# Altium schematic sheet KHKT25.SchDoc
size A
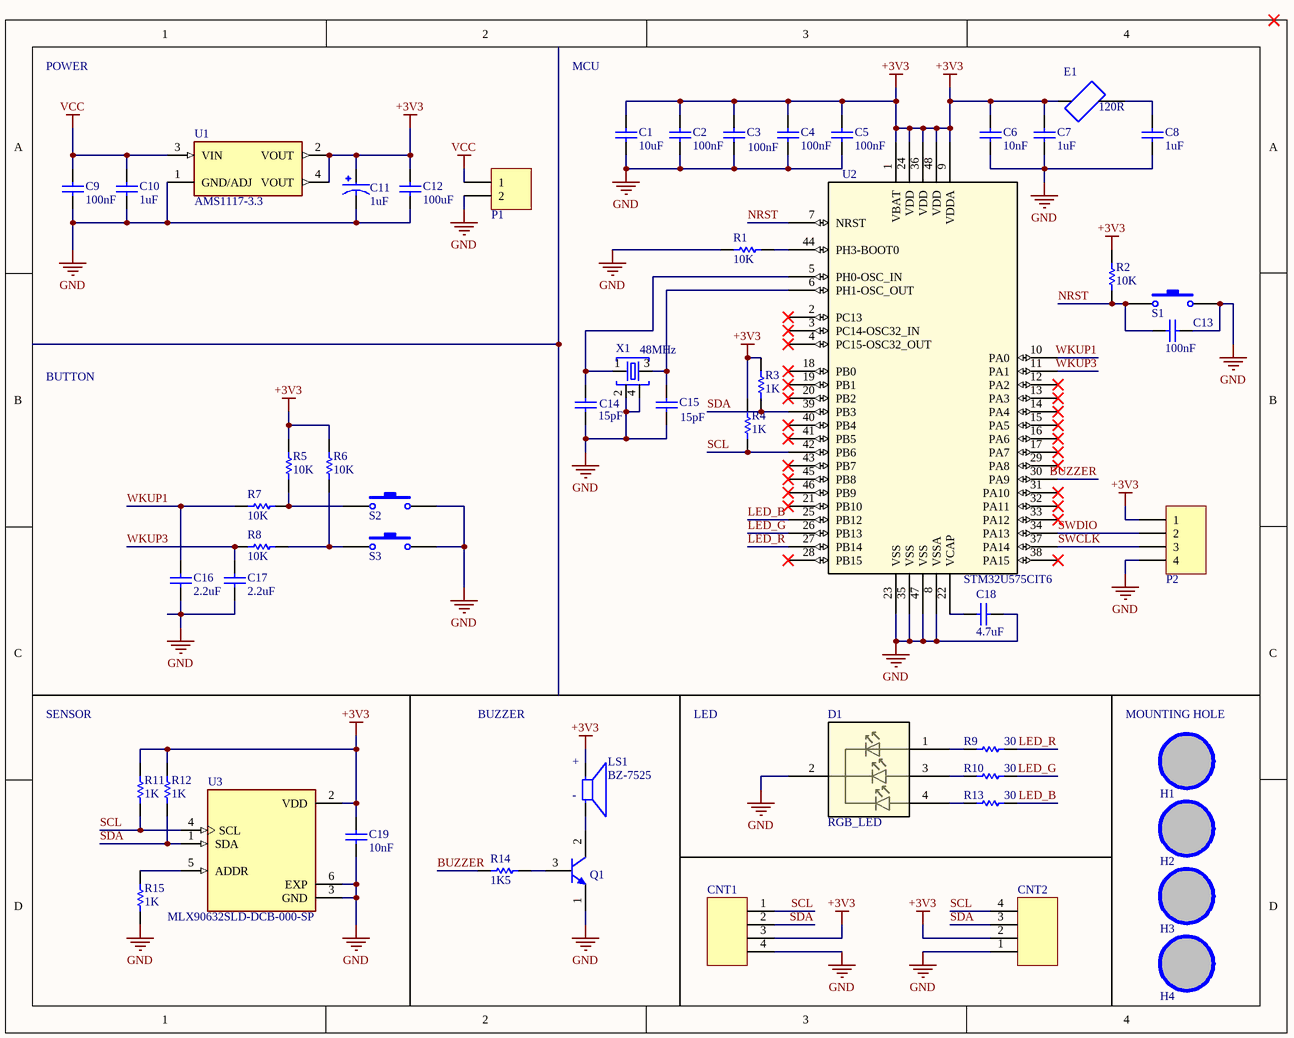
[diagram p0: KHKT25.SchDoc]

## Parts
C1  value 10uF  [CAP-SM-0603]  (hidden comment: Cap Non-Pol SMD)
C2  value 100nF  [CAP-SM-0603]  (hidden comment: Cap Non-Pol SMD)
C3  value 100nF  [CAP-SM-0603]  (hidden comment: Cap Non-Pol SMD)
C4  value 100nF  [CAP-SM-0603]  (hidden comment: Cap Non-Pol SMD)
C5  value 100nF  [CAP-SM-0603]  (hidden comment: Cap Non-Pol SMD)
C6  value 10nF  [CAP-SM-0603]  (hidden comment: Cap Non-Pol SMD)
C7  value 1uF  [CAP-SM-0603]  (hidden comment: Cap Non-Pol SMD)
C8  value 1uF  [CAP-SM-0603]  (hidden comment: Cap Non-Pol SMD)
C9  value 100nF  [CAP-SM-0603]  (hidden comment: Cap Non-Pol SMD)
C10  value 1uF  [CAP-SM-0603]  (hidden comment: Cap Non-Pol SMD)
C11  1uF  [CAP_TAN_3216]
C12  value 100uF  [CAP-SM-0603]  (hidden comment: Cap Non-Pol SMD)
C13  value 100nF  [CAP-SM-0603]  (hidden comment: Cap Non-Pol SMD)
C14  value 15pF  [CAP-SM-0603]  (hidden comment: Cap Non-Pol SMD)
C15  value 15pF  [CAP-SM-0603]  (hidden comment: Cap Non-Pol SMD)
C16  value 2.2uF  [CAP-SM-0603]  (hidden comment: Cap Non-Pol SMD)
C17  value 2.2uF  [CAP-SM-0603]  (hidden comment: Cap Non-Pol SMD)
C18  value 4.7uF  [CAP-SM-0603]  (hidden comment: Cap Non-Pol SMD)
C19  value 10nF  [CAP_0402]  (hidden comment: Cap Non-Pol SMD)
CNT1  HF4X1  [FPC_FFC_4P]  (value not drawn)
CNT2  HF4X1  [FPC_FFC_4P]  (value not drawn)
D1  RGB_LED  [RGB_LED]
E1  120R  [FB_MI0805K400R-10]
H1  Hole  [LO KHOAN 3MM]  (value not drawn)
H2  Hole  [LO KHOAN 3MM]  (value not drawn)
H3  Hole  [LO KHOAN 3MM]  (value not drawn)
H4  Hole  [LO KHOAN 3MM]  (value not drawn)
LS1  BZ-7525  [XDCCMT-7525]
P1  Header 2  [DOMINO_2P]  (value not drawn)
P2  Header 4H  [JP4]  (value not drawn)
Q1  C1815  [SOT23B]  (value not drawn)
R1  value 10K  [RES-SM-0603]  (hidden comment: RESISTOR SMD)
R2  value 10K  [RES-SM-0603]  (hidden comment: RESISTOR SMD)
R3  value 1K  [RES-SM-0603]  (hidden comment: RESISTOR SMD)
R4  value 1K  [RES-SM-0603]  (hidden comment: RESISTOR SMD)
R5  value 10K  [RES-SM-0603]  (hidden comment: RESISTOR SMD)
R6  value 10K  [RES-SM-0603]  (hidden comment: RESISTOR SMD)
R7  value 10K  [RES-SM-0603]  (hidden comment: RESISTOR SMD)
R8  value 10K  [RES-SM-0603]  (hidden comment: RESISTOR SMD)
R9  value 30  [RES-SM-0603]  (hidden comment: RESISTOR SMD)
R10  value 30  [RES-SM-0603]  (hidden comment: RESISTOR SMD)
R11  value 1K  [RES_0402]  (hidden comment: RESISTOR SMD)
R12  value 1K  [RES_0402]  (hidden comment: RESISTOR SMD)
R13  value 30  [RES-SM-0603]  (hidden comment: RESISTOR SMD)
R14  value 1K5  [RES-SM-0603]  (hidden comment: RESISTOR SMD)
R15  value 1K  [RES_0402]  (hidden comment: RESISTOR SMD)
S1  Tact SW - 2Pin  [SW_SMD]  (value not drawn)
S2  Tact SW - 2Pin  [SW_SMD]  (value not drawn)
S3  Tact SW - 2Pin  [SW_SMD]  (value not drawn)
U1  AMS1117-3.3  [SOT223-4N]
U2  STM32U575CIT6  [LQFP48-7x7mm_STM]
U3  MLX90632SLD-DCB-000-SP  [MLX90632]
X1  48MHz  [TSX-3225]

## Nets
+3V3: C1.2 C2.2 C3.2 C4.2 C5.2 C6.2 C7.2 C11.1 C12.2 C19.2 CNT1.3 CNT2.2 E1.1 LS1.P P2.1 R2.1 R3.1 R4.1 R5.1 R6.1 R11.1 R12.1 U1.2(VOUT) U1.4(VOUT) U2.1(VBAT) U2.9(VDDA) U2.24(VDD) U2.36(VDD) U2.48(VDD) U3.2(VDD)
GND: C1.1 C2.1 C3.1 C4.1 C5.1 C6.1 C7.1 C8.1 C9.1 C10.1 C11.2 C12.1 C13.2 C14.1 C15.1 C16.1 C17.1 C18.1 C19.1 CNT1.4 CNT2.1 D1.2 P1.2 P2.4 Q1.1(E) R1.2 R15.2 S1.2 S2.2 S3.2 U1.1(GND/ADJ) U2.8(VSSA) U2.23(VSS) U2.35(VSS) U2.47(VSS) U3.3(GND) U3.6(EXP) X1.2 X1.4
VCC: C9.2 C10.2 P1.1 U1.3(VIN)
BUZZER: R14.1 U2.30(PA9)
LED_B: R13.1 U2.25(PB12)
LED_G: R10.1 U2.26(PB13)
LED_R: R9.1 U2.27(PB14)
NRST: C13.1 R2.2 S1.1 U2.7(NRST)
SCL: CNT1.1 CNT2.4 R4.2 R11.2 U2.42(PB6) U3.4(SCL)
SDA: CNT1.2 CNT2.3 R3.2 R12.2 U2.39(PB3) U3.1(SDA)
SWCLK: P2.3 U2.37(PA14)
SWDIO: P2.2 U2.34(PA13)
WKUP1: C16.2 R7.1 U2.10(PA0)
WKUP3: C17.2 R8.1 U2.11(PA1)
NetC8_2: C8.2 E1.2
NetC14_2: C14.2 U2.5(PH0-OSC_IN) X1.1
NetC15_2: C15.2 U2.6(PH1-OSC_OUT) X1.3
NetC18_2: C18.2 U2.22(VCAP)
NetD1_1: D1.1 R9.2
NetD1_3: D1.3 R10.2
NetD1_4: D1.4 R13.2
NetLS1_N: LS1.N Q1.2(C)
NetQ1_3: Q1.3(B) R14.2
NetR1_1: R1.1 U2.44(PH3-BOOT0)
NetR5_2: R5.2 R7.2 S2.1
NetR6_2: R6.2 R8.2 S3.1
NetR15_1: R15.1 U3.5(ADDR)

Not connected (* = marked no-connect by the designer): H1 1; H2 1; H3 1; H4 1; U2 2(PC13)* 3(PC14-OSC32_IN)* 4(PC15-OSC32_OUT)* 12(PA2)* 13(PA3)* 14(PA4)* 15(PA5)* 16(PA6)* 17(PA7)* 18(PB0)* 19(PB1)* 20(PB2)* 21(PB10)* 28(PB15)* 29(PA8)* 31(PA10)* 32(PA11)* 33(PA12)* 38(PA15)* 40(PB4)* 41(PB5)* 43(PB7)* 45(PB8)* 46(PB9)*

## Notes on the sheet
- POWER
- MCU
- BUTTON
- SENSOR
- BUZZER
- LED
- (near H1) MOUNTING HOLE
- (in symbol BZ-7525) +; -

## Library data of the parts
C1-C10 C12-C19 = Cap Non-Pol SMD: Capacitor
C11 = Cap_Tantalum: 3216; MF: KEMET; MP: T491A475K025AT; SnapEDA_Link: https://www.snapeda.com/parts/T491A475K025AT/KEMET/view-part/?ref=snap; Package: SMD-2 KEMET; Value: *; Check_prices: https://www.snapeda.com/parts/T491A475K025AT/KEMET/view-part/?ref=eda
D1 = RGB_LED: Description; Manufacturer_Name: Kingbright; Manufacturer_Part_Number: L-154A4SURKQBDZGW; Type: LED Lighting; Copyright: Copyright (C) 2025 Ultra Librarian. All rights reserved.; RefDes: RefDes
E1 = MI0805K400R-10: EMI Ferrite Chip Bead, 0805, 1500MA, 40 Ohms @100MHz, DCR Max 0.050Ohm | Laird Performance Materials MI0805K400R-10; MF: Laird-Signal Integrity Products; SnapEDA_Link: https://www.snapeda.com/parts/MI0805K400R-10/Laird-Signal+Integrity+Products/view-part/?ref=snap; Package: 0805 Laird; Value: *; MP: MI0805K400R-10; Check_prices: https://www.snapeda.com/parts/MI0805K400R-10/Laird-Signal+Integrity+Products/view-part/?ref=eda
H1-H4 = Hole: Hole 3mm
LS1 = BZ-7525: 7.5 mm, 3.6 Vo-p, 80 dB, Surface Mount (SMT), Magnetic Audio Transducer Buzzer; MF: Same Sky; MP: CMT-7525-80-SMT-TR; SnapEDA_Link: https://www.snapeda.com/parts/CMT-7525-80-SMT-TR/Same+Sky/view-part/?ref=snap; Package: CUI Devices; Value: *; Check_prices: https://www.snapeda.com/parts/CMT-7525-80-SMT-TR/Same+Sky/view-part/?ref=eda
P1 = Header 2: Header, 2-Pin; LatestRevisionDate: 17-Jul-2002; LatestRevisionNote: Re-released for DXP Platform.; Publisher: Altium Limited
P2 = Header 4H: Header, 4-Pin, Right Angle; LatestRevisionDate: 17-Jul-2002; LatestRevisionNote: Re-released for DXP Platform.; Publisher: Altium Limited
Q1 = C1815: NPN Bipolar Transistor
R1-R15 = RESISTOR SMD: Resistor
S1-S3 = Tact SW - 2Pin: Switch button 2 pin
U1 = AMS1117-3.3: Sot223/Pkg 1-Amp 3.3-Volt Low Drop Out Voltage Regulatator; MF: Advanced Monolithic Systems; SnapEDA_Link: https://www.snapeda.com/parts/AMS1117-3.3/Advanced+Monolithic+Systems/view-part/?ref=snap; Package: SOT-223 Seeed Technology; Value: *; MP: AMS1117-3.3; Check_prices: https://www.snapeda.com/parts/AMS1117-3.3/Advanced+Monolithic+Systems/view-part/?ref=eda
U2 = STM32U575CIT6: Ultra-low-power with FPU Arm Cortex-M33 MCU with TrustZone, 160 MHz with 2 Mbytes of Flash memory; Manufacturer_Name: STMicroelectronics; Copyright: Copyright (C) 2025 Ultra Librarian. All rights reserved.; Manufacturer_Part_Number: STM32U575CIT6; RefDes: RefDes; Type: Type
U3 = MLX90632SLD-BCB-000-SP: Package: None; Price: None; Value: *; MP: MLX90632SLD-BCB-000-SP; Availability: Unavailable
X1 = TSX-3225: Crystal; MF: EPSON; Package: SMD-4 Epson; Price: None; SnapEDA_Link: https://www.snapeda.com/parts/TSX-3225/EPSON/view-part/557780/?ref=snap; Availability: Unavailable; Value: *; MP: TSX-3225